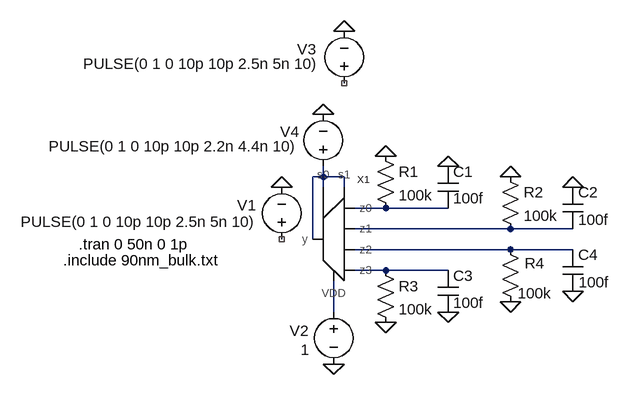
[diagram p0: schematic demux_test.asc]
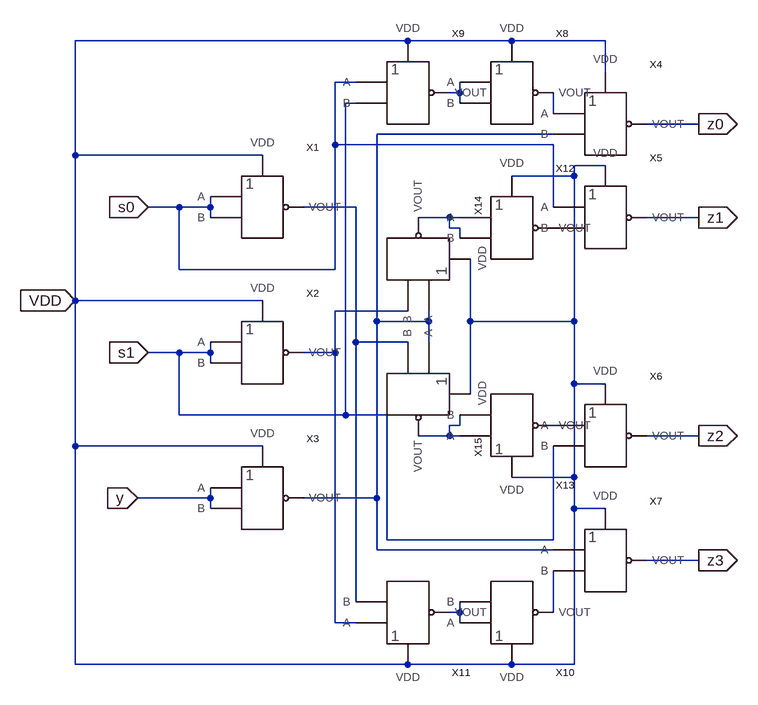
[diagram p1: sub-circuit demux.asc]
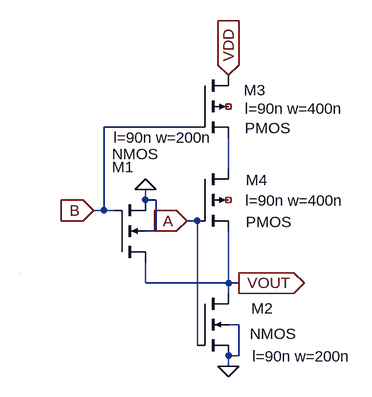
[diagram p2: sub-circuit nor.asc]
demux_test.asc, the LTspice schematic file:
Version 4
SHEET 1 880 680
WIRE 192 80 192 64
WIRE 192 80 176 80
WIRE 224 80 192 80
WIRE 192 96 192 80
WIRE 224 96 224 80
WIRE 288 128 240 128
WIRE 384 128 288 128
WIRE 480 160 240 160
WIRE 576 160 480 160
WIRE 176 176 176 80
WIRE 480 192 240 192
WIRE 576 192 480 192
WIRE 288 224 240 224
WIRE 384 224 288 224
WIRE 208 288 208 240
FLAG 208 368 0
FLAG 128 96 0
FLAG 192 -16 0
FLAG 224 -144 0
FLAG 288 48 0
FLAG 384 64 0
FLAG 480 80 0
FLAG 576 96 0
FLAG 480 272 0
FLAG 576 256 0
FLAG 384 288 0
FLAG 288 304 0
SYMBOL demux 208 176 R0
SYMATTR InstName X1
SYMBOL voltage 224 -48 R180
WINDOW 0 43 68 Left 2
WINDOW 3 37 46 Left 2
WINDOW 123 0 0 Left 0
WINDOW 39 0 0 Left 0
SYMATTR InstName V3
SYMATTR Value PULSE(0 1 0 10p 10p 2.5n 5n 10)
SYMBOL res 272 32 R0
SYMATTR InstName R1
SYMATTR Value 100k
SYMBOL cap 368 64 R0
WINDOW 3 24 49 Left 2
SYMATTR InstName C1
SYMATTR Value 100f
SYMBOL res 464 64 R0
SYMATTR InstName R2
SYMATTR Value 100k
SYMBOL cap 560 96 R0
WINDOW 3 24 50 Left 2
SYMATTR InstName C2
SYMATTR Value 100f
SYMBOL res 272 208 R0
SYMATTR InstName R3
SYMATTR Value 100k
SYMBOL cap 368 224 R0
WINDOW 3 24 50 Left 2
SYMATTR InstName C3
SYMATTR Value 100f
SYMBOL res 464 176 R0
WINDOW 0 38 37 Left 2
WINDOW 3 27 83 Left 2
SYMATTR InstName R4
SYMATTR Value 100k
SYMBOL cap 560 192 R0
WINDOW 3 25 50 Left 2
SYMATTR InstName C4
SYMATTR Value 100f
SYMBOL voltage 192 80 R180
WINDOW 0 37 69 Left 2
WINDOW 3 38 47 Left 2
WINDOW 123 0 0 Left 0
WINDOW 39 0 0 Left 0
SYMATTR InstName V4
SYMATTR Value PULSE(0 1 0 10p 10p 2.2n 4.4n 10)
SYMBOL voltage 128 192 R180
WINDOW 0 39 68 Left 2
WINDOW 3 37 43 Left 2
WINDOW 123 0 0 Left 0
WINDOW 39 0 0 Left 0
SYMATTR InstName V1
SYMATTR Value PULSE(0 1 0 10p 10p 2.5n 5n 10)
SYMBOL voltage 208 272 R0
WINDOW 0 -68 45 Left 2
WINDOW 3 -51 74 Left 2
WINDOW 123 0 0 Left 0
WINDOW 39 0 0 Left 0
SYMATTR InstName V2
SYMATTR Value 1
TEXT -184 184 Left 2 !.tran 0 50n 0 1p
TEXT -208 208 Left 2 !.include 90nm_bulk.txt

demux.asc, the sub-circuit schematic file:
Version 4
SHEET 1 880 744
WIRE 144 -256 -368 -256
WIRE 304 -256 144 -256
WIRE 448 -256 304 -256
WIRE 448 -208 448 -256
WIRE 64 -192 32 -192
WIRE 224 -176 224 -192
WIRE 224 -176 208 -176
WIRE 64 -160 48 -160
WIRE 224 -160 224 -176
WIRE 368 -144 368 -176
WIRE 592 -128 512 -128
WIRE 368 -112 96 -112
WIRE 32 -96 32 -192
WIRE 368 -96 32 -96
WIRE -368 -80 -368 -256
WIRE -80 -80 -368 -80
WIRE 448 -64 400 -64
WIRE 400 -48 400 -64
WIRE 400 -48 304 -48
WIRE -208 0 -256 0
WIRE -160 0 -160 -16
WIRE -160 0 -208 0
WIRE 64 0 -16 0
WIRE 368 0 368 -96
WIRE -160 16 -160 0
WIRE 208 16 160 16
WIRE 224 16 208 16
WIRE 592 16 512 16
WIRE 208 32 208 16
WIRE 224 32 208 32
WIRE 224 48 224 32
WIRE -208 96 -208 0
WIRE 32 96 32 -96
WIRE 32 96 -208 96
WIRE -368 144 -368 -80
WIRE -80 144 -368 144
WIRE 144 160 32 160
WIRE 96 176 96 -112
WIRE 176 176 176 160
WIRE 176 176 96 176
WIRE 240 176 240 80
WIRE 400 176 400 -48
WIRE 400 176 240 176
WIRE 64 208 64 0
WIRE 144 208 64 208
WIRE 176 208 176 176
WIRE -208 224 -256 224
WIRE -160 224 -160 208
WIRE -160 224 -208 224
WIRE 32 224 32 160
WIRE 32 224 -16 224
WIRE -160 240 -160 224
WIRE 400 272 400 176
WIRE 448 272 400 272
WIRE 240 288 240 176
WIRE -208 320 -208 224
WIRE 48 320 48 -160
WIRE 48 320 -208 320
WIRE 112 320 48 320
WIRE 224 336 224 320
WIRE 224 336 208 336
WIRE 208 352 208 336
WIRE 208 352 160 352
WIRE 224 352 208 352
WIRE 592 352 512 352
WIRE -368 368 -368 144
WIRE -80 368 -368 368
WIRE 400 416 400 272
WIRE 400 416 304 416
WIRE -160 448 -160 432
WIRE -160 448 -272 448
WIRE 96 448 96 176
WIRE 96 448 -16 448
WIRE -160 464 -160 448
WIRE 400 464 400 416
WIRE 448 464 400 464
WIRE 112 512 112 320
WIRE 368 512 368 368
WIRE 368 512 112 512
WIRE 96 528 96 448
WIRE 368 528 96 528
WIRE 592 544 512 544
WIRE 64 608 64 208
WIRE 224 624 224 608
WIRE 224 624 208 624
WIRE 368 624 368 560
WIRE 32 640 32 224
WIRE 64 640 32 640
WIRE 224 640 224 624
WIRE -368 704 -368 368
WIRE 144 704 -368 704
WIRE 304 704 144 704
WIRE 400 704 400 464
WIRE 400 704 304 704
FLAG -256 0 s0
IOPIN -256 0 In
FLAG -256 224 s1
IOPIN -256 224 In
FLAG -272 448 y
IOPIN -272 448 In
FLAG 592 -128 z0
IOPIN 592 -128 Out
FLAG 592 16 z1
IOPIN 592 16 Out
FLAG 592 352 z2
IOPIN 592 352 Out
FLAG 592 544 z3
IOPIN 592 544 Out
FLAG -368 144 VDD
IOPIN -368 144 In
SYMBOL NOR -112 0 R0
SYMATTR InstName X1
SYMBOL NOR -112 224 R0
SYMATTR InstName X2
SYMBOL NOR -112 448 R0
SYMATTR InstName X3
SYMBOL NOR 416 -128 R0
SYMATTR InstName X4
SYMBOL NOR 416 544 R0
SYMATTR InstName X7
SYMBOL NOR 272 -176 R0
SYMATTR InstName X8
SYMBOL NOR 112 -176 R0
SYMATTR InstName X9
SYMBOL NOR 272 624 M180
SYMATTR InstName X10
SYMBOL NOR 112 624 M180
SYMATTR InstName X11
SYMBOL NOR 416 352 R0
SYMATTR InstName X6
SYMBOL NOR 416 16 R0
SYMATTR InstName X5
SYMBOL NOR 272 32 R0
SYMATTR InstName X12
SYMBOL NOR 272 336 M180
SYMATTR InstName X13
SYMBOL NOR 160 112 M270
SYMATTR InstName X14
SYMBOL NOR 160 256 R90
SYMATTR InstName X15

nor.asc, the sub-circuit schematic file:
Version 4
SHEET 1 880 680
WIRE 272 -224 128 -224
WIRE 320 -160 320 -208
WIRE 192 -112 192 -128
WIRE 208 -112 192 -112
WIRE 128 -96 128 -224
WIRE 128 -96 112 -96
WIRE 144 -96 128 -96
WIRE 272 -80 256 -80
WIRE 208 -64 208 -112
WIRE 208 -64 192 -64
WIRE 192 16 192 -16
WIRE 320 16 320 -64
WIRE 320 16 192 16
WIRE 336 16 320 16
WIRE 320 32 320 16
WIRE 336 80 320 80
WIRE 272 112 272 -80
WIRE 336 128 336 80
WIRE 336 128 320 128
WIRE 320 144 320 128
WIRE 0 0 0 0
FLAG 192 -128 0
FLAG 320 144 0
FLAG 256 -80 A
IOPIN 256 -80 In
FLAG 112 -96 B
IOPIN 112 -96 In
FLAG 336 16 VOUT
IOPIN 336 16 Out
FLAG 320 -304 VDD
IOPIN 320 -304 In
SYMBOL nmos4 144 -16 M180
WINDOW 123 -1 192 Left 2
WINDOW 0 -3 147 Left 2
WINDOW 3 -3 167 Left 2
SYMATTR Value2 l=90n w=200n
SYMATTR InstName M1
SYMBOL nmos4 272 32 R0
WINDOW 123 85 97 Left 2
WINDOW 0 83 23 Left 2
WINDOW 3 81 62 Left 2
SYMATTR Value2 l=90n w=200n
SYMATTR InstName M2
SYMBOL pmos4 272 -304 R0
WINDOW 123 73 51 Left 2
WINDOW 0 72 23 Left 2
WINDOW 3 73 81 Left 2
SYMATTR Value2 l=90n w=400n
SYMATTR InstName M3
SYMBOL pmos4 272 -160 R0
WINDOW 123 74 49 Left 2
WINDOW 0 75 17 Left 2
WINDOW 3 75 82 Left 2
SYMATTR Value2 l=90n w=400n
SYMATTR InstName M4

The netlist it stands for:
* demux_test.asc
XX1 N001 N001 N001 N002 N003 N004 N005 N006 demux
V3 NC_01 0 PULSE(0 1 0 10p 10p 2.5n 5n 10)
R1 0 N002 100k
C1 0 N002 100f
R2 0 N003 100k
C2 0 N003 100f
R3 N005 0 100k
C3 N005 0 100f
R4 N004 0 100k
C4 N004 0 100f
V4 N001 0 PULSE(0 1 0 10p 10p 2.2n 4.4n 10)
V1 NC_02 0 PULSE(0 1 0 10p 10p 2.5n 5n 10)
V2 N006 0 1

* block symbol definitions
.subckt demux y s0 s1 z0 z1 z2 z3 VDD
XX1 s0 s0 N004 VDD nor
XX2 s1 s1 N006 VDD nor
XX3 y y N003 VDD nor
XX4 N002 N003 z0 VDD nor
XX7 N003 N009 z3 VDD nor
XX8 N001 N001 N002 VDD nor
XX9 s0 s1 N001 VDD nor
XX10 N008 N008 N009 VDD nor
XX11 N006 N004 N008 VDD nor
XX6 P001 s1 z2 VDD nor
XX5 s0 P002 z1 VDD nor
XX12 N005 N005 P002 VDD nor
XX13 N007 N007 P001 VDD nor
XX14 N003 N006 N005 VDD nor
XX15 N003 N004 N007 VDD nor
.ends demux

.subckt nor A B VOUT VDD
M1 VOUT B 0 0 NMOS l=90n w=200n
M2 VOUT A 0 0 NMOS l=90n w=200n
M3 VDD B N001 NC_01 PMOS l=90n w=400n
M4 N001 A VOUT NC_02 PMOS l=90n w=400n
.ends nor

.model NMOS NMOS
.model PMOS PMOS
.lib standard.mos
.tran 0 50n 0 1p
.include 90nm_bulk.txt
.backanno
.end